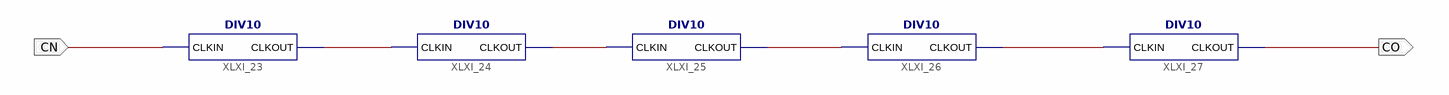
[diagram p0: schematic sheet 1]
// Xilinx ISE schematic Div100K.sch (spartan6) as structural Verilog: 5 symbols, 2 ports
module Div100K (
  input  CN,
  output CO
);

  wire o1, o2, o3, XLXN_19;

  DIV10 XLXI_23 (.CLKIN(CN), .CLKOUT(o1));
  DIV10 XLXI_24 (.CLKIN(o1), .CLKOUT(o2));
  DIV10 XLXI_25 (.CLKIN(o2), .CLKOUT(o3));
  DIV10 XLXI_26 (.CLKIN(o3), .CLKOUT(XLXN_19));
  DIV10 XLXI_27 (.CLKIN(XLXN_19), .CLKOUT(CO));
endmodule
